# Altium project Socket 2.PrjPcb
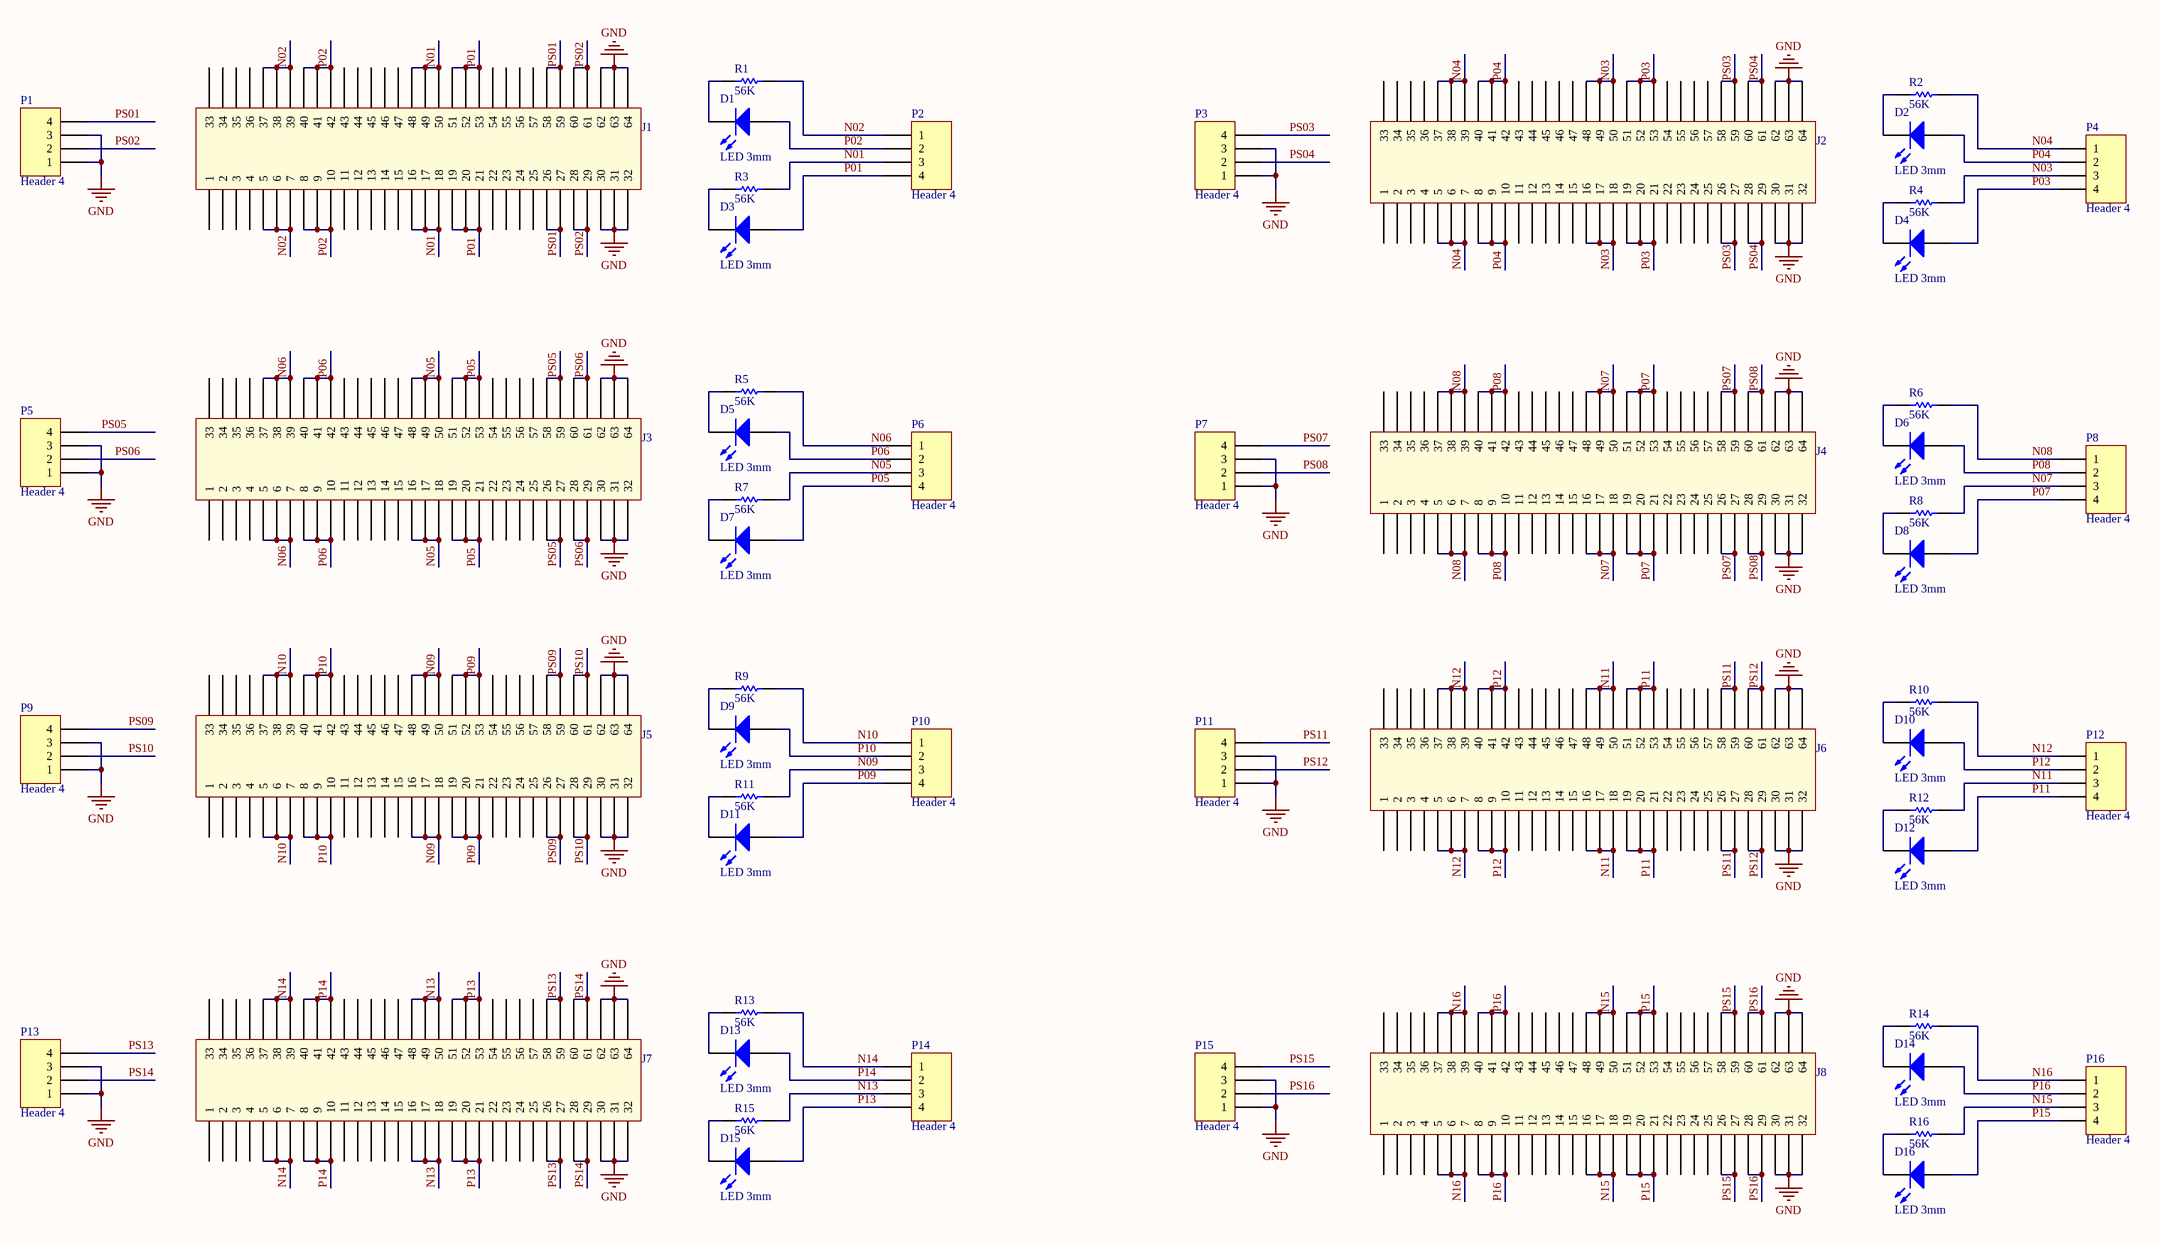
[diagram p0: Sheet1.SchDoc]
1 sheet, 56 parts. Net scope: global (net labels, ports and power ports of the same name join across sheets).
Board file: PCB1.PcbDoc

## Sheet Sheet1.SchDoc
size C

### Parts
D1  LED 3mm  [Led 3mm]
D2  LED 3mm  [Led 3mm]
D3  LED 3mm  [Led 3mm]
D4  LED 3mm  [Led 3mm]
D5  LED 3mm  [Led 3mm]
D6  LED 3mm  [Led 3mm]
D7  LED 3mm  [Led 3mm]
D8  LED 3mm  [Led 3mm]
D9  LED 3mm  [Led 3mm]
D10  LED 3mm  [Led 3mm]
D11  LED 3mm  [Led 3mm]
D12  LED 3mm  [Led 3mm]
D13  LED 3mm  [Led 3mm]
D14  LED 3mm  [Led 3mm]
D15  LED 3mm  [Led 3mm]
D16  LED 3mm  [Led 3mm]
J1  Header 32x2  [Header32x2]  (value not drawn)
J2  Header 32x2  [Header32x2]  (value not drawn)
J3  Header 32x2  [Header32x2]  (value not drawn)
J4  Header 32x2  [Header32x2]  (value not drawn)
J5  Header 32x2  [Header32x2]  (value not drawn)
J6  Header 32x2  [Header32x2]  (value not drawn)
J7  Header 32x2  [Header32x2]  (value not drawn)
J8  Header 32x2  [Header32x2]  (value not drawn)
P1  Header 4  [CON4]
P2  Header 4  [CON4]
P3  Header 4  [CON4]
P4  Header 4  [CON4]
P5  Header 4  [CON4]
P6  Header 4  [CON4]
P7  Header 4  [CON4]
P8  Header 4  [CON4]
P9  Header 4  [CON4]
P10  Header 4  [CON4]
P11  Header 4  [CON4]
P12  Header 4  [CON4]
P13  Header 4  [CON4]
P14  Header 4  [CON4]
P15  Header 4  [CON4]
P16  Header 4  [CON4]
R1  value 56K  [R1/8W]  (hidden comment: Res1)
R2  value 56K  [R1/8W]  (hidden comment: Res1)
R3  value 56K  [R1/8W]  (hidden comment: Res1)
R4  value 56K  [R1/8W]  (hidden comment: Res1)
R5  value 56K  [R1/8W]  (hidden comment: Res1)
R6  value 56K  [R1/8W]  (hidden comment: Res1)
R7  value 56K  [R1/8W]  (hidden comment: Res1)
R8  value 56K  [R1/8W]  (hidden comment: Res1)
R9  value 56K  [R1/8W]  (hidden comment: Res1)
R10  value 56K  [R1/8W]  (hidden comment: Res1)
R11  value 56K  [R1/8W]  (hidden comment: Res1)
R12  value 56K  [R1/8W]  (hidden comment: Res1)
R13  value 56K  [R1/8W]  (hidden comment: Res1)
R14  value 56K  [R1/8W]  (hidden comment: Res1)
R15  value 56K  [R1/8W]  (hidden comment: Res1)
R16  value 56K  [R1/8W]  (hidden comment: Res1)

### Nets
GND: J1.30 J1.31 J1.32 J1.62 J1.63 J1.64 J2.30 J2.31 J2.32 J2.62 J2.63 J2.64 J3.30 J3.31 J3.32 J3.62 J3.63 J3.64 J4.30 J4.31 J4.32 J4.62 J4.63 J4.64 J5.30 J5.31 J5.32 J5.62 J5.63 J5.64 J6.30 J6.31 J6.32 J6.62 J6.63 J6.64 J7.30 J7.31 J7.32 J7.62 J7.63 J7.64 J8.30 J8.31 J8.32 J8.62 J8.63 J8.64 P1.1 P1.3 P3.1 P3.3 P5.1 P5.3 P7.1 P7.3 P9.1 P9.3 P11.1 P11.3 P13.1 P13.3 P15.1 P15.3
N01: J1.16 J1.17 J1.18 J1.48 J1.49 J1.50 P2.3 R3.1
N02: J1.5 J1.6 J1.7 J1.37 J1.38 J1.39 P2.1 R1.1
N03: J2.16 J2.17 J2.18 J2.48 J2.49 J2.50 P4.3 R4.1
N04: J2.5 J2.6 J2.7 J2.37 J2.38 J2.39 P4.1 R2.1
N05: J3.16 J3.17 J3.18 J3.48 J3.49 J3.50 P6.3 R7.1
N06: J3.5 J3.6 J3.7 J3.37 J3.38 J3.39 P6.1 R5.1
N07: J4.16 J4.17 J4.18 J4.48 J4.49 J4.50 P8.3 R8.1
N08: J4.5 J4.6 J4.7 J4.37 J4.38 J4.39 P8.1 R6.1
N09: J5.16 J5.17 J5.18 J5.48 J5.49 J5.50 P10.3 R11.1
N10: J5.5 J5.6 J5.7 J5.37 J5.38 J5.39 P10.1 R9.1
N11: J6.16 J6.17 J6.18 J6.48 J6.49 J6.50 P12.3 R12.1
N12: J6.5 J6.6 J6.7 J6.37 J6.38 J6.39 P12.1 R10.1
N13: J7.16 J7.17 J7.18 J7.48 J7.49 J7.50 P14.3 R15.1
N14: J7.5 J7.6 J7.7 J7.37 J7.38 J7.39 P14.1 R13.1
N15: J8.16 J8.17 J8.18 J8.48 J8.49 J8.50 P16.3 R16.1
N16: J8.5 J8.6 J8.7 J8.37 J8.38 J8.39 P16.1 R14.1
P01: D3.1(A) J1.19 J1.20 J1.21 J1.51 J1.52 J1.53 P2.4
P02: D1.1(A) J1.8 J1.9 J1.10 J1.40 J1.41 J1.42 P2.2
P03: D4.1(A) J2.19 J2.20 J2.21 J2.51 J2.52 J2.53 P4.4
P04: D2.1(A) J2.8 J2.9 J2.10 J2.40 J2.41 J2.42 P4.2
P05: D7.1(A) J3.19 J3.20 J3.21 J3.51 J3.52 J3.53 P6.4
P06: D5.1(A) J3.8 J3.9 J3.10 J3.40 J3.41 J3.42 P6.2
P07: D8.1(A) J4.19 J4.20 J4.21 J4.51 J4.52 J4.53 P8.4
P08: D6.1(A) J4.8 J4.9 J4.10 J4.40 J4.41 J4.42 P8.2
P09: D11.1(A) J5.19 J5.20 J5.21 J5.51 J5.52 J5.53 P10.4
P10: D9.1(A) J5.8 J5.9 J5.10 J5.40 J5.41 J5.42 P10.2
P11: D12.1(A) J6.19 J6.20 J6.21 J6.51 J6.52 J6.53 P12.4
P12: D10.1(A) J6.8 J6.9 J6.10 J6.40 J6.41 J6.42 P12.2
P13: D15.1(A) J7.19 J7.20 J7.21 J7.51 J7.52 J7.53 P14.4
P14: D13.1(A) J7.8 J7.9 J7.10 J7.40 J7.41 J7.42 P14.2
P15: D16.1(A) J8.19 J8.20 J8.21 J8.51 J8.52 J8.53 P16.4
P16: D14.1(A) J8.8 J8.9 J8.10 J8.40 J8.41 J8.42 P16.2
PS01: J1.26 J1.27 J1.58 J1.59 P1.4
PS02: J1.28 J1.29 J1.60 J1.61 P1.2
PS03: J2.26 J2.27 J2.58 J2.59 P3.4
PS04: J2.28 J2.29 J2.60 J2.61 P3.2
PS05: J3.26 J3.27 J3.58 J3.59 P5.4
PS06: J3.28 J3.29 J3.60 J3.61 P5.2
PS07: J4.26 J4.27 J4.58 J4.59 P7.4
PS08: J4.28 J4.29 J4.60 J4.61 P7.2
PS09: J5.26 J5.27 J5.58 J5.59 P9.4
PS10: J5.28 J5.29 J5.60 J5.61 P9.2
PS11: J6.26 J6.27 J6.58 J6.59 P11.4
PS12: J6.28 J6.29 J6.60 J6.61 P11.2
PS13: J7.26 J7.27 J7.58 J7.59 P13.4
PS14: J7.28 J7.29 J7.60 J7.61 P13.2
PS15: J8.26 J8.27 J8.58 J8.59 P15.4
PS16: J8.28 J8.29 J8.60 J8.61 P15.2
NetD1_2: D1.2(K) R1.2
NetD2_2: D2.2(K) R2.2
NetD3_2: D3.2(K) R3.2
NetD4_2: D4.2(K) R4.2
NetD5_2: D5.2(K) R5.2
NetD6_2: D6.2(K) R6.2
NetD7_2: D7.2(K) R7.2
NetD8_2: D8.2(K) R8.2
NetD9_2: D9.2(K) R9.2
NetD10_2: D10.2(K) R10.2
NetD11_2: D11.2(K) R11.2
NetD12_2: D12.2(K) R12.2
NetD13_2: D13.2(K) R13.2
NetD14_2: D14.2(K) R14.2
NetD15_2: D15.2(K) R15.2
NetD16_2: D16.2(K) R16.2

Not connected (* = marked no-connect by the designer): J1 1 2 3 4 11 12 13 14 15 22 23 24 25 33 34 35 36 43 44 45 46 47 54 55 56 57; J2 1 2 3 4 11 12 13 14 15 22 23 24 25 33 34 35 36 43 44 45 46 47 54 55 56 57; J3 1 2 3 4 11 12 13 14 15 22 23 24 25 33 34 35 36 43 44 45 46 47 54 55 56 57; J4 1 2 3 4 11 12 13 14 15 22 23 24 25 33 34 35 36 43 44 45 46 47 54 55 56 57; J5 1 2 3 4 11 12 13 14 15 22 23 24 25 33 34 35 36 43 44 45 46 47 54 55 56 57; J6 1 2 3 4 11 12 13 14 15 22 23 24 25 33 34 35 36 43 44 45 46 47 54 55 56 57; J7 1 2 3 4 11 12 13 14 15 22 23 24 25 33 34 35 36 43 44 45 46 47 54 55 56 57; J8 1 2 3 4 11 12 13 14 15 22 23 24 25 33 34 35 36 43 44 45 46 47 54 55 56 57

### Library data of the parts
D1-D16 = LED0: Typical INFRARED GaAs LED; Published: 8-Jun-2000; LatestRevisionDate: 08-Jul-2005; LatestRevisionNote: Mech Layer 1 removed.; PackageReference: LED-0; Publisher: Altium Limited; PackageDescription: LED; 2 Leads
P1-P16 = Header 4: Header, 4-Pin; LatestRevisionDate: 17-Jul-2002; LatestRevisionNote: Re-released for DXP Platform.; Publisher: Altium Limited
R1-R16 = Res1: Resistor; Published: 8-Jun-2000; LatestRevisionDate: 17-Jul-2002; LatestRevisionNote: Re-released for DXP Platform.; PackageReference: AXIAL-0.3; Publisher: Altium Limited; PackageDescription: Axial Device, Thru-Hole; 2 Leads; 0.3 in Pin Spacing